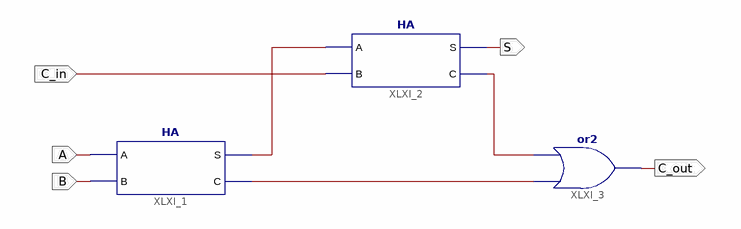
[diagram p0: schematic sheet 1]
// Xilinx ISE schematic FA.sch (spartan3e) as structural Verilog: 3 symbols, 5 ports
module FA (
  input  A,
  input  B,
  input  C_in,
  output S,
  output C_out
);

  wire XLXN_1, XLXN_6, XLXN_8;

  HA XLXI_1 (.A(A), .B(B), .S(XLXN_1), .C(XLXN_6));
  HA XLXI_2 (.A(XLXN_1), .B(C_in), .S(S), .C(XLXN_8));
  or XLXI_3 (C_out, XLXN_6, XLXN_8);
endmodule
